# Altium schematic sheet [17]-SP2_BUCKs_GPU_LOG_CPU-B.SchDoc: RK3399 SOM Board Design V1.0
size A3; Author: ABC; Organization: Altium Limited; Address1: L3, 12a Rodborough Rd; Address2: Frenchs Forest; Address3: NSW; Address4: Australia 2086; DocumentNumber: 19; SheetNumber: 19; SheetTotal: 21; PROJECT CODE: A_V1.0
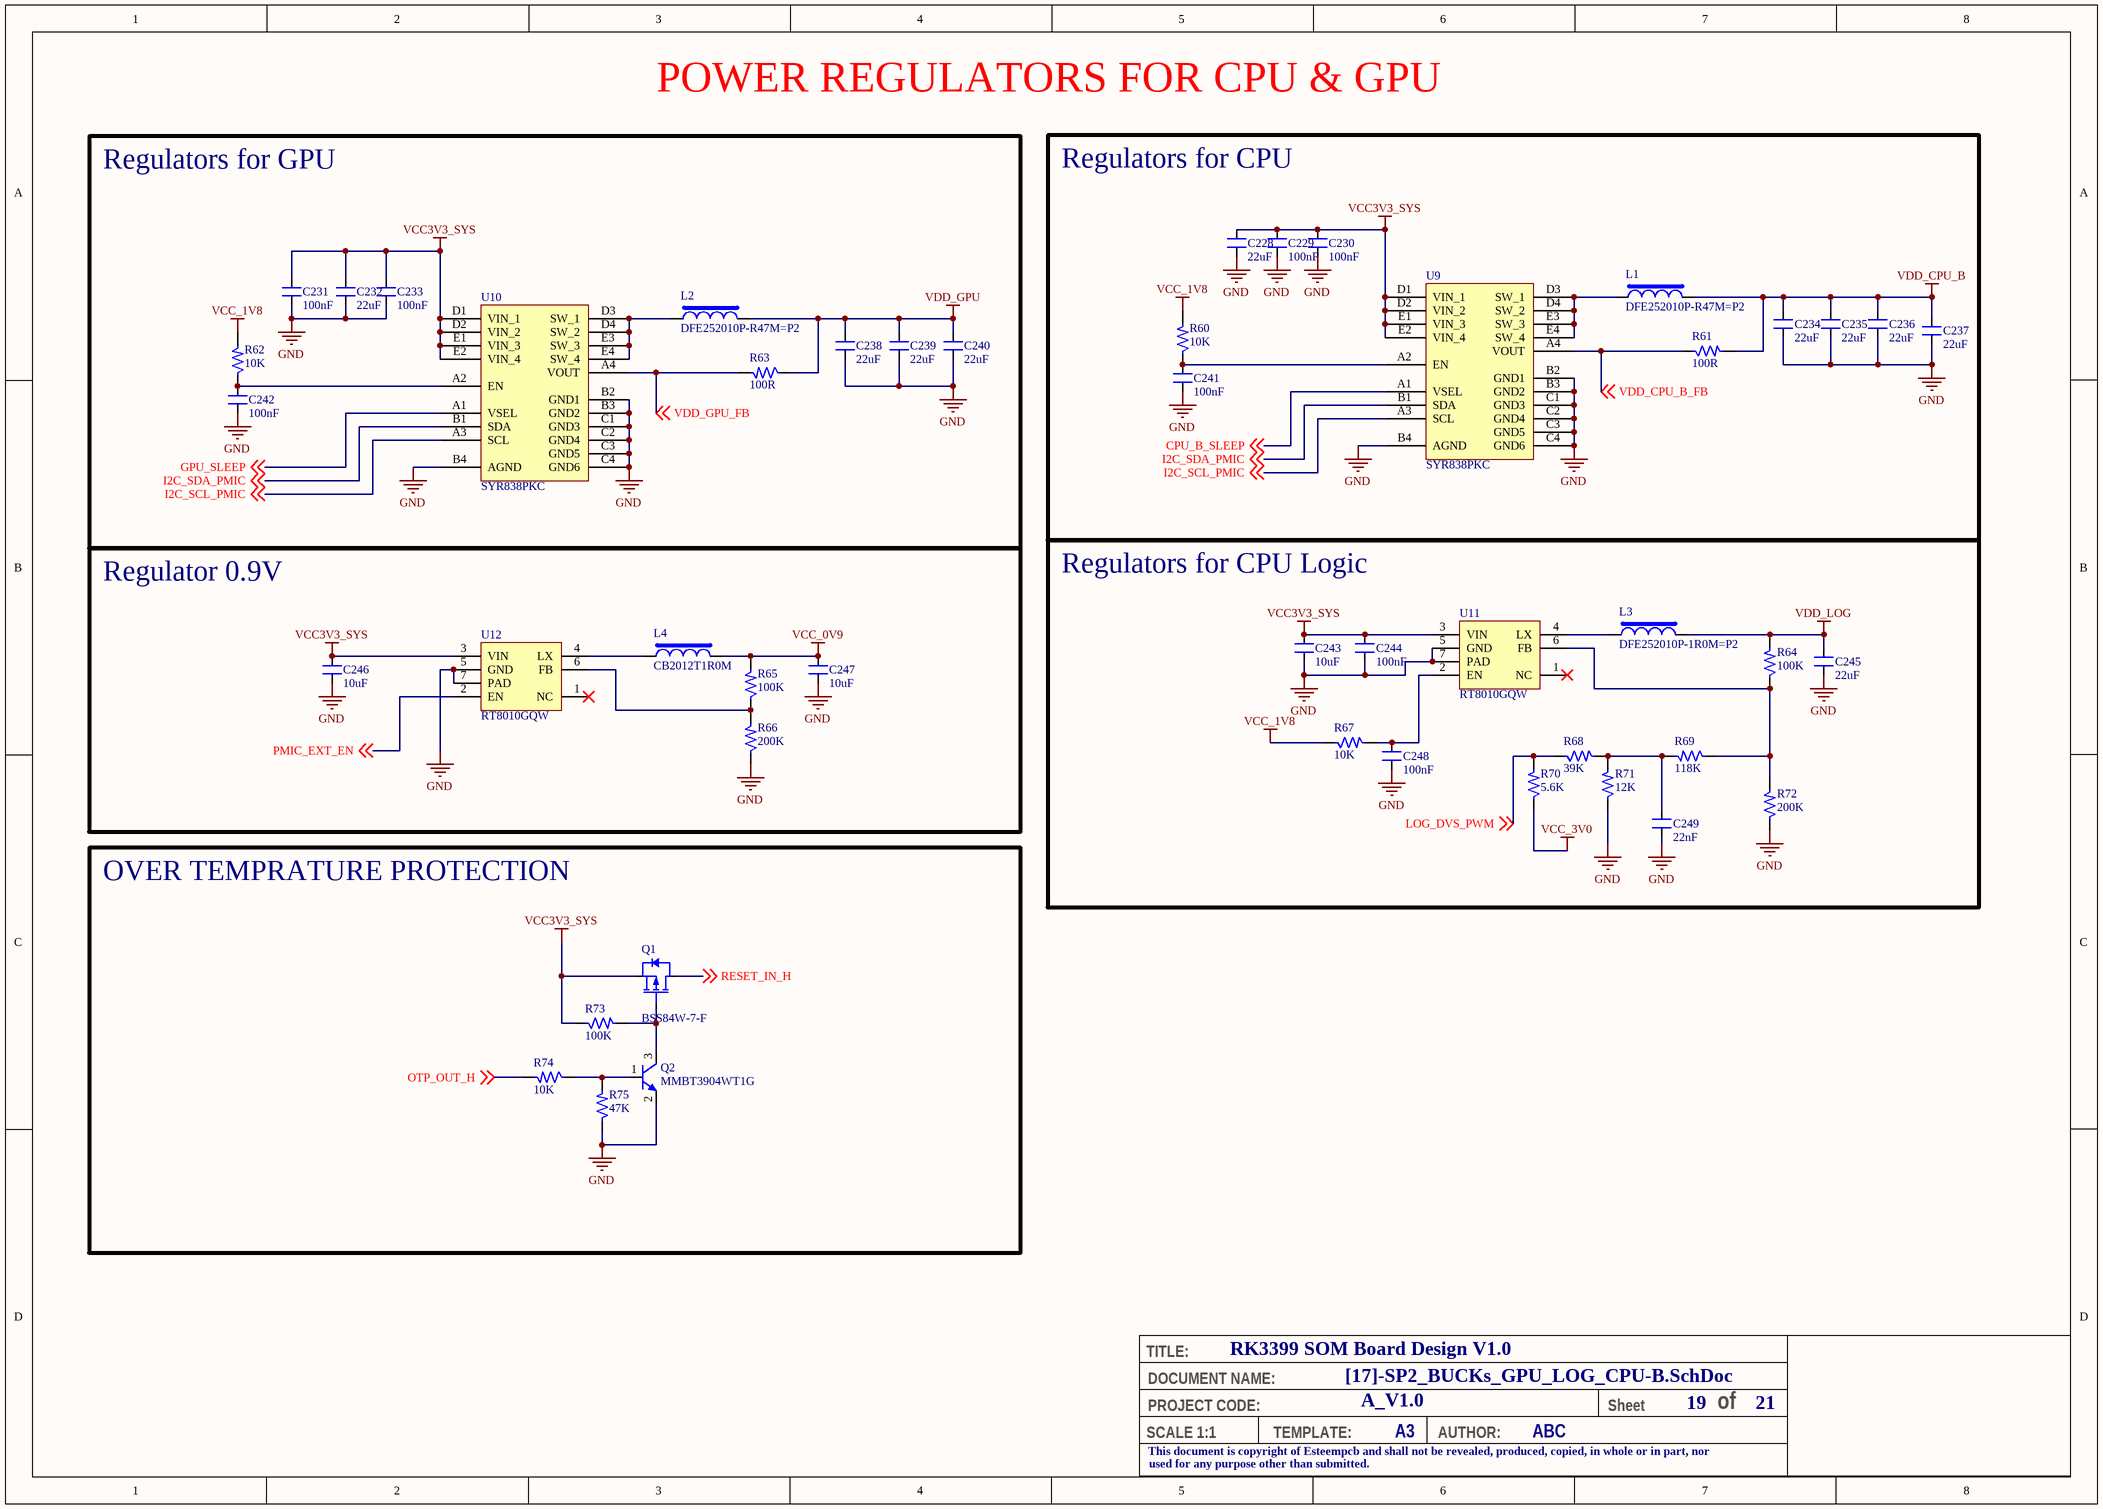
[diagram p0: [17]-SP2_BUCKs_GPU_LOG_CPU-B.SchDoc]

## Parts
C228  22uF  [CAP_0603]
C229  100nF  [CAP_0402]
C230  100nF  [CAP_0402]
C231  100nF  [CAP_0402]
C232  22uF  [CAP_0603]
C233  100nF  [CAP_0402]
C234  22uF  [CAP_0603]
C235  22uF  [CAP_0603]
C236  22uF  [CAP_0603]
C237  22uF  [CAP_0603]
C238  22uF  [CAP_0603]
C239  22uF  [CAP_0603]
C240  22uF  [CAP_0603]
C241  100nF  [CAP_0402]
C242  100nF  [CAP_0402]
C243  10uF  [CAP_0402]
C244  100nF  [CAP_0402]
C245  22uF  [CAP_0603]
C246  10uF  [CAP_0402]
C247  10uF  [CAP_0402]
C248  100nF  [CAP_0402]
C249  22nF  [CAP_0402]
L1  DFE252010P-R47M=P2  [IND_1008]
L2  DFE252010P-R47M=P2  [IND_1008]
L3  DFE252010P-1R0M=P2  [IND_1008]
L4  CB2012T1R0M  [IND_0805]
Q1  BSS84W-7-F  [SOT-323-3]
Q2  MMBT3904WT1G  [SOT-323-3]
R60  10K  [RES_0402]
R61  100R  [RES_0402]
R62  10K  [RES_0402]
R63  100R  [RES_0402]
R64  100K  [RES_0402]
R65  100K  [RES_0402]
R66  200K  [RES_0402]
R67  10K  [RES_0402]
R68  39K  [RES_0402]
R69  118K  [RES_0402]
R70  5.6K  [RES_0402]
R71  12K  [RES_0402]
R72  200K  [RES_0402]
R73  100K  [RES_0402]
R74  10K  [RES_0402]
R75  47K  [RES_0402]
U9  SYR838PKC  [CSP20_15.7_100x84_SMD]
U10  SYR838PKC  [CSP20_15.7_100x84_SMD]
U11  RT8010GQW  [WDFN-6_26_133X100_SMD]
U12  RT8010GQW  [WDFN-6_26_133X100_SMD]

## Blocks framed on the sheet
Regulators for GPU: C231-C233 C238-C240 C242 L2 R62 R63 U10
Regulators for CPU: C228-C230 C234-C237 C241 L1 R60 R61 U9
Regulator 0.9V: C246 C247 L4 R65 R66 U12
Regulators for CPU Logic: C243-C245 C248 C249 L3 R64 R67-R72 U11
OVER TEMPRATURE PROTECTION: Q1 Q2 R73-R75

## Nets
GND: C228.1 C229.1 C230.1 C231.1 C232.1 C233.1 C234.1 C235.1 C236.1 C237.1 C238.1 C239.1 C240.1 C241.1 C242.1 C243.1 C244.1 C245.1 C246.1 C247.1 C248.1 C249.1 Q2.2(E) R66.1 R71.1 R72.1 R75.1 U9.B2(GND1) U9.B3(GND2) U9.B4(AGND) U9.C1(GND3) U9.C2(GND4) U9.C3(GND5) U9.C4(GND6) U10.B2(GND1) U10.B3(GND2) U10.B4(AGND) U10.C1(GND3) U10.C2(GND4) U10.C3(GND5) U10.C4(GND6) U11.5(GND) U11.7(PAD) U12.5(GND) U12.7(PAD)
VCC3V3_SYS: C228.2 C229.2 C230.2 C231.2 C232.2 C233.2 C243.2 C244.2 C246.2 Q1.2(S) R73.1 U9.D1(VIN_1) U9.D2(VIN_2) U9.E1(VIN_3) U9.E2(VIN_4) U10.D1(VIN_1) U10.D2(VIN_2) U10.E1(VIN_3) U10.E2(VIN_4) U11.3(VIN) U12.3(VIN)
VCC_0V9: C247.2 L4.2 R65.2
VCC_1V8: R60.2 R62.2 R67.1
VCC_3V0: R70.1
VDD_CPU_B: C234.2 C235.2 C236.2 C237.2 L1.2 R61.2
VDD_GPU: C238.2 C239.2 C240.2 L2.2 R63.1
VDD_LOG: C245.2 L3.2 R64.2
CPU_B_SLEEP: U9.A1(VSEL) ; off-sheet CPU_B_SLEEP
GPU_SLEEP: U10.A1(VSEL) ; off-sheet GPU_SLEEP
I2C_SCL_PMIC: U9.A3(SCL) U10.A3(SCL) ; off-sheet I2C_SCL_PMIC
I2C_SDA_PMIC: U9.B1(SDA) U10.B1(SDA) ; off-sheet I2C_SDA_PMIC
LOG_DVS_PWM: R68.1 R70.2 ; off-sheet LOG_DVS_PWM
OTP_OUT_H: R74.2 ; off-sheet OTP_OUT_H
PMIC_EXT_EN: U12.2(EN) ; off-sheet PMIC_EXT_EN
RESET_IN_H: Q1.3(D) ; off-sheet RESET_IN_H
VDD_CPU_B_FB: R61.1 U9.A4(VOUT) ; off-sheet VDD_CPU_B_FB
VDD_GPU_FB: R63.2 U10.A4(VOUT) ; off-sheet VDD_GPU_FB
NetC241_2: C241.2 R60.1 U9.A2(EN)
NetC242_2: C242.2 R62.1 U10.A2(EN)
NetC248_2: C248.2 R67.2 U11.2(EN)
NetC249_2: C249.2 R68.2 R69.2 R71.2
NetL1_1: L1.1 U9.D3(SW_1) U9.D4(SW_2) U9.E3(SW_3) U9.E4(SW_4)
NetL2_1: L2.1 U10.D3(SW_1) U10.D4(SW_2) U10.E3(SW_3) U10.E4(SW_4)
NetL3_1: L3.1 U11.4(LX)
NetL4_1: L4.1 U12.4(LX)
NetQ1_1: Q1.1(G) Q2.3(C) R73.2
NetQ2_1: Q2.1(B) R74.1 R75.2
NetR64_1: R64.1 R69.1 R72.2 U11.6(FB)
NetR65_1: R65.1 R66.2 U12.6(FB)

Not connected (* = marked no-connect by the designer): U11 1(NC)*; U12 1(NC)*

## Notes on the sheet
- POWER REGULATORS FOR CPU & GPU
- TITLE:
- DOCUMENT NAME:
- SCALE 1:1
- This document is copyright of Esteempcb and shall not be revealed, produced, copied, in whole or in part, nor
- PROJECT CODE:
- TEMPLATE:
- A3
- AUTHOR:
- Sheet
- of
- used for any purpose other than submitted.

## Library data of the parts
C228 C232 C234-C240 C245 = CAP_22uF-10V-20%-0603: 22µF ±20% 10V Ceramic Capacitor X5R 0603 (1608 Metric) /; Manufacturer: Murata Electronics; Manufacturer Part Number: GRM188R61A226ME15D; Case/Package: 0603; Supplier-1: Digikey
C229-C231 C233 C241 C242 C244 C248 = CAP_100nF-25V-10%-0402: 0.1µF ±10% 25V Ceramic Capacitor X7R 0402 (1005 Metric) /; Manufacturer: Walsin Technology Corporation; Manufacturer Part Number: 0402B104K250CT; Case/Package: 0402; Supplier-1: Digikey
C243 C246 C247 = CAP_10uF-10V-20%-0402: 10µF ±20% 10V Ceramic Capacitor X5R 0402 (1005 Metric) /; Manufacturer Part Number: CL05A106MP5NUNC; Manufacturer: Samsung Electro-Mechanics; Case/Package: 0402; Supplier-1: Digikey
C249 = CAP_22nF-10V-10%-0402: 0.022µF ±10% 10V Ceramic Capacitor X7R 0402 (1005 Metric) /; Manufacturer: Samsung Electro-Mechanics; Manufacturer Part Number: CL05B223KP5NNNC; Case/Package: 0402; Supplier-1: Digikey
L1 L2 = IND_470nH-5A-20%-1008: 470nH Shielded Wirewound Inductor 5A 35mOhm Max 1008 (2520 Metric); Manufacturer: Murata Electronics; Manufacturer Part Number: DFE252010P-R47M=P2; Case/Package: 1008; Supplier-1: Digikey
L3 = IND_1uH-3.8A-20%-1008: 1µH Shielded Wirewound Inductor 3.8A 54mOhm Max 1008 (2520 Metric) /; Manufacturer: Murata Electronics; Manufacturer Part Number: DFE252010P-1R0M=P2; Case/Package: 1008; Supplier-1: Digikey
L4 = IND_1uF-0.5A-20%-0805: 1uH ±20% 500mA 150mΩ 0805 Inductors (SMD) RoHS /; Manufacturer: Taiyo Yuden; Manufacturer Part Number: CB2012T1R0M; Case/Package: 0805; Supplier-1: LCSC
Q1 = MOSFET-P_50V-130mA-SOT-323: P-Channel 50V 130mA (Ta) 200mW (Ta) Surface Mount SOT-323; Manufacturer: Diodes Incorporated; Manufacturer Part Number: BSS84W-7-F; Case/Package: SOT-323; Supplier-1: Digikey
Q2 = TRNS-NPN_60V-0.2A-SOT323: Bipolar Transistors - BJT 200mA 60V NPN; Manufacturer: ON Semiconductor; Manufacturer Part Number: MMBT3904WT1G; Case/Package: SOT323; Supplier-1: Digikey
R60 R62 R67 R74 = RES_10K-0.1W-1%-0402: 10 kOhms ±1% 0.1W, 1/10W Chip Resistor 0402 (1005 Metric) Anti-Sulfur Thin Film /; Manufacturer: Vishay Beyschlag/Draloric/BC Components; Manufacturer Part Number: MCS04020C1002FE000; Case/Package: 0402; Supplier-1: Digikey
R61 R63 = RES_100R-0.1W-1%-0402: 100 Ohms ±1% 0.1W, 1/10W Chip Resistor 0402 (1005 Metric) Automotive AEC-Q200, Moisture Resistant Thick Film /; Manufacturer: KOA Speer Electronics, Inc.; Manufacturer Part Number: RK73H1ETTP1000F; Case/Package: 0402; Supplier-1: Digikey
R64 R65 R73 = RES_100K-0.1W-1%-0402: 100 kOhms ±1% 0.1W, 1/10W Chip Resistor 0402 (1005 Metric) Anti-Sulfur Thin Film /; Manufacturer: Vishay Beyschlag/Draloric/BC Components; Manufacturer Part Number: MCS04020C1003FE000; Case/Package: 0402; Supplier-1: Digikey
R66 R72 = RES_200K-0.1W-1%-0402: 200 kOhms ±1% 0.1W, 1/10W Chip Resistor 0402 (1005 Metric) Automotive AEC-Q200 Thick Film /; Manufacturer: Panasonic Electronic Components; Manufacturer Part number: ERJ-2RKF2003X; Case/Package: 0402; Supplier-1: Digikey
R68 = RES_39K-0.1W-1%-0402: 39 kOhms ±1% 0.1W, 1/10W Chip Resistor 0402 (1005 Metric) Automotive AEC-Q200, Moisture Resistant Thick Film /; Manufacturer: KOA Speer Electronics, Inc.; Manufacturer Part Number: RK73H1ETTP3902F; Case/Package: 0402; Supplier-1: Digikey
R69 = RES_118K-0.1W-1%-0402: 118 kOhms ±1% 0.1W, 1/10W Chip Resistor 0402 (1005 Metric) Automotive AEC-Q200, Moisture Resistant Thick Film /; Manufacturer: KOA Speer Electronics, Inc.; Manuafcturer Part Number: RK73H1ETTP1183F; Case/Package: 0402; Supplier-1: Digikey
R70 = RES_5.6K-0.1W-1%-0402: 5.6 kOhms ±1% 0.1W, 1/10W Chip Resistor 0402 (1005 Metric) Automotive AEC-Q200, Moisture Resistant Thick Film /; Manufacturer: KOA Speer Electronics, Inc.; Manufacturer Part Number: RK73H1ETTP5601F; Case/Package: 0402; Supplier-1: Digikey
R71 = RES_12K-0.1W-1%-0402: 12 kOhms ±1% 0.1W, 1/10W Chip Resistor 0402 (1005 Metric) Anti-Sulfur Thin Film /; Manufacturer: Vishay Beyschlag/Draloric/BC Components; Manufacturer Part Number: MCS04020C1202FE000; Case/Package: 0402; Supplier-1: Digikey
R75 = RES_47K-0.1W-1%-0402: 47 kOhms ±1% 0.1W, 1/10W Chip Resistor 0402 (1005 Metric) Automotive AEC-Q200 Thick Film /; Manufacturer: Panasonic Electronic Components; Manufacturer Part Number: ERJ-2RKF4702X; Case/Package: 0402; Supplier-1: Digikey
U9 U10 = IC_SYR838PKC: Step-Down Positive Programmable 1 6A 2.4MHz CSP1.56*1.96-20 DC-DC Converters RoHS; Manufacturer: Silergy Corp; Manufacturer Part Number: SYR838PKC; Case/Package: CSP1.56*1.96-20; Supplier-1: LCSC
U11 U12 = REG-ADJ_5.5V-5.5V-1A-6-WDFN: Buck Switching Regulator IC Positive Adjustable 0.6V 1 Output 1A 6-WDFN Exposed Pad; Manufacturer: Richtek USA Inc.; Manufacturer Part Number: RT8010GQW; Case/Package: 6-WDFN; Supplier-1: Digikey